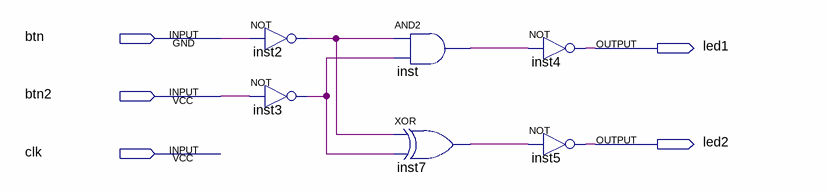
[diagram p0: schematic sheet]
// Quartus schematic blinky02.bdf as structural Verilog: 6 symbols, 5 pins
module blinky02 (
  input  btn,
  input  btn2,
  input  clk,
  output led1,
  output led2
);

  wire inst2_out, inst3_out, inst7_out, inst_out;

  not inst2 (inst2_out, btn);
  not inst3 (inst3_out, btn2);
  and inst (inst_out, inst2_out, inst3_out);
  xor inst7 (inst7_out, inst2_out, inst3_out);
  not inst4 (led1, inst_out);
  not inst5 (led2, inst7_out);
endmodule
